# EAGLE design M304A (EAGLE 6.6.0)
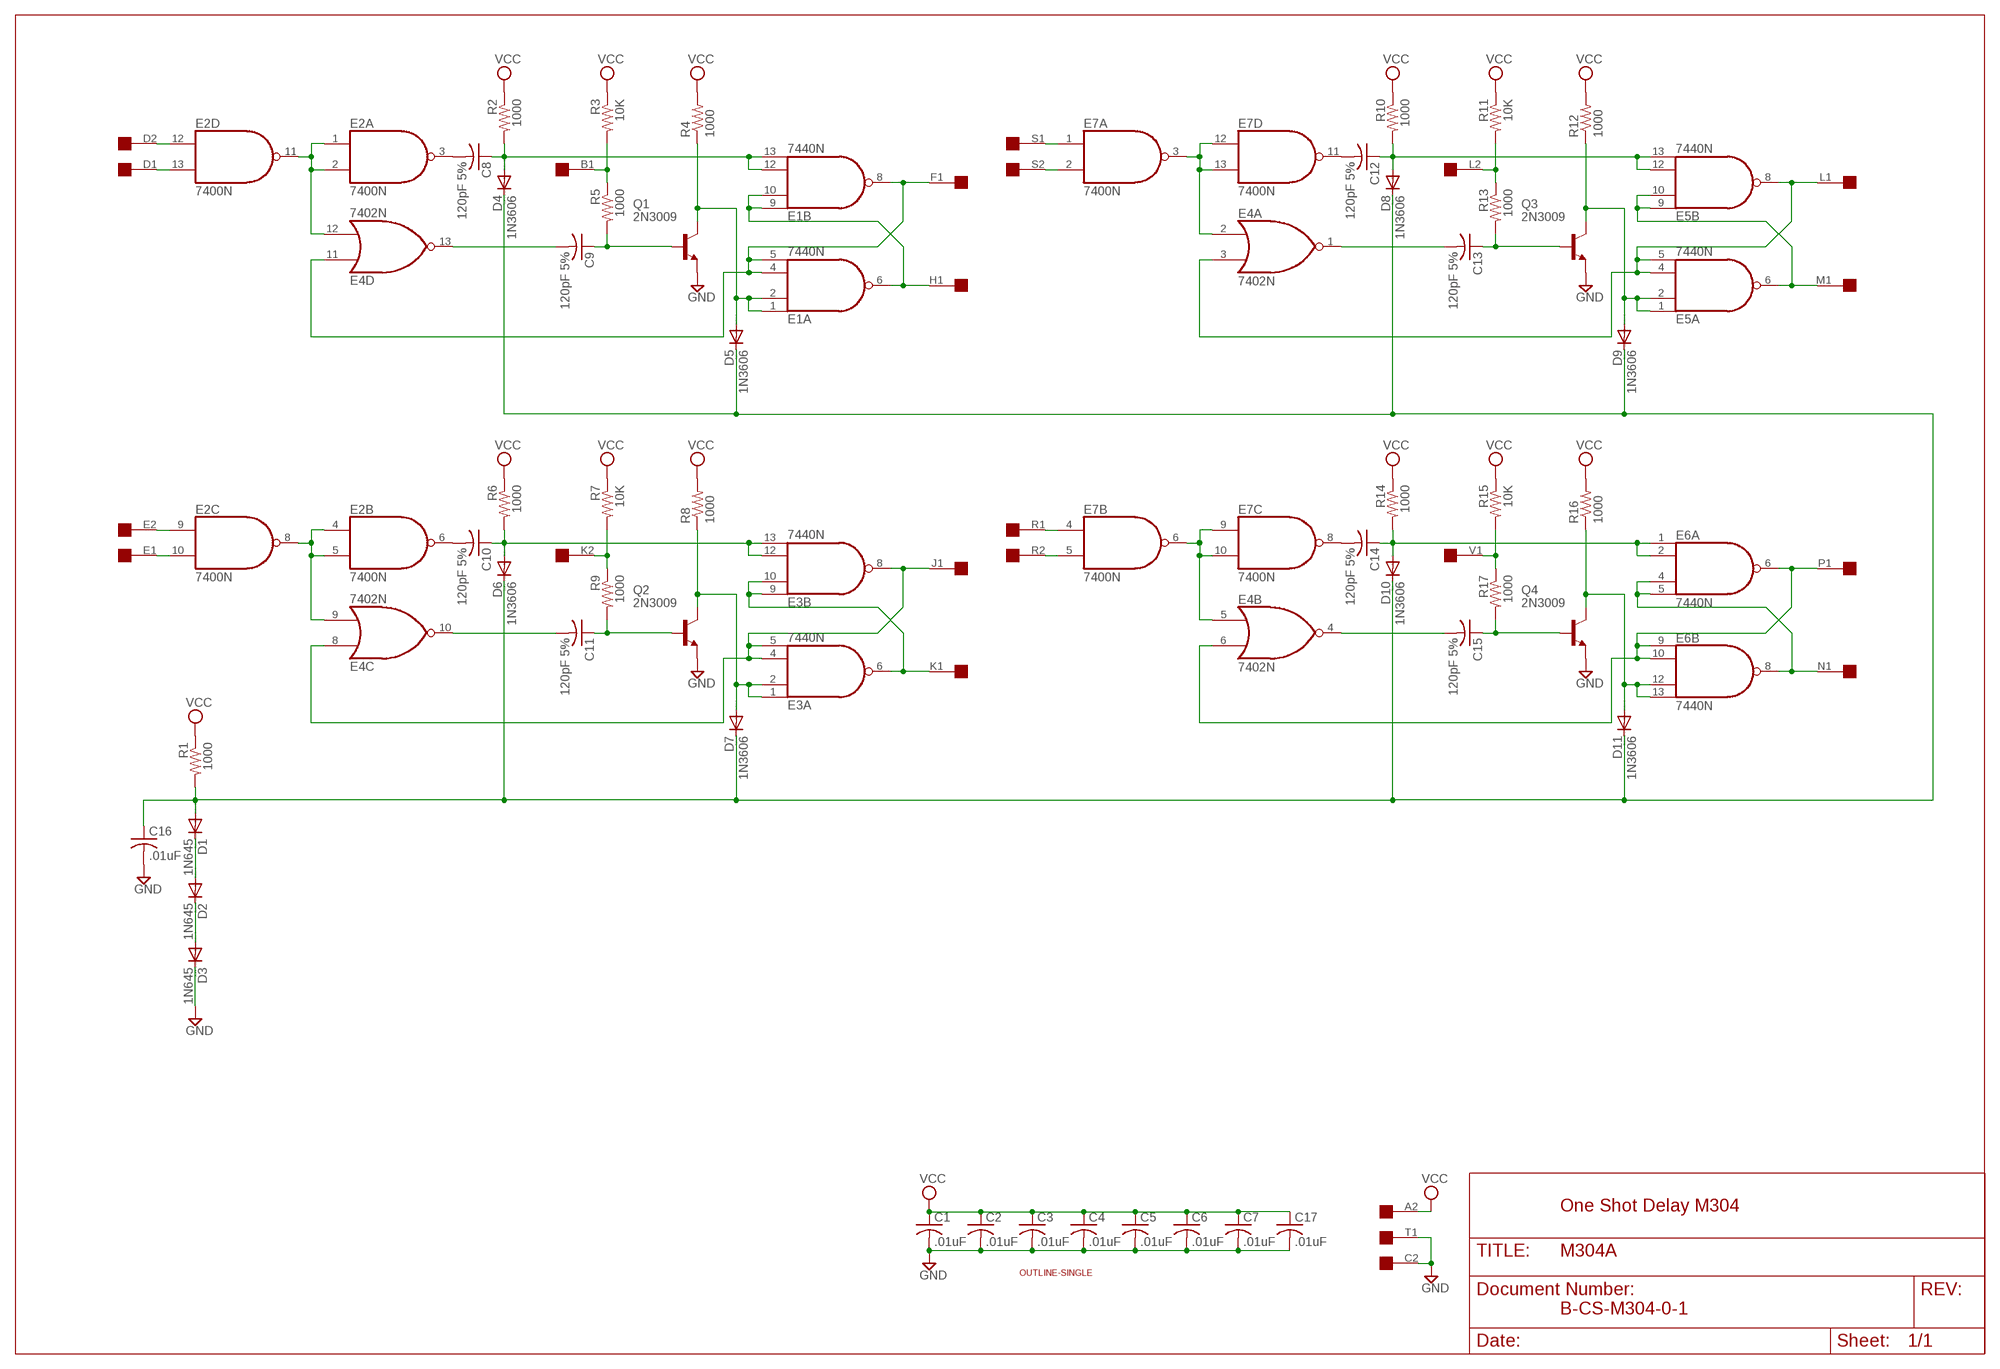
[diagram p0: schematic, sheet 1]

## Parts
C1  .01uF  C-US050-025X075  [C050-025X075]
C2  .01uF  C-US050-025X075  [C050-025X075]
C3  .01uF  C-US050-025X075  [C050-025X075]
C4  .01uF  C-US050-025X075  [C050-025X075]
C5  .01uF  C-US050-025X075  [C050-025X075]
C6  .01uF  C-US050-025X075  [C050-025X075]
C7  .01uF  C-US050-025X075  [C050-025X075]
C8  120pF 5%  C-US050-025X075  [C050-025X075]
C9  120pF 5%  C-US050-025X075  [C050-025X075]
C10  120pF 5%  C-US050-025X075  [C050-025X075]
C11  120pF 5%  C-US050-025X075  [C050-025X075]
C12  120pF 5%  C-US050-025X075  [C050-025X075]
C13  120pF 5%  C-US050-025X075  [C050-025X075]
C14  120pF 5%  C-US050-025X075  [C050-025X075]
C15  120pF 5%  C-US050-025X075  [C050-025X075]
C16  .01uF  C-US050-025X075  [C050-025X075]
C17  .01uF  C-US050-025X075  [C050-025X075]
D1  1N645  1N4148DO35-10  [DO35-10]
D2  1N645  1N4148DO35-10  [DO35-10]
D3  1N645  1N4148DO35-10  [DO35-10]
D4  1N3606  1N4148DO35-10  [DO35-10]
D5  1N3606  1N4148DO35-10  [DO35-10]
D6  1N3606  1N4148DO35-10  [DO35-10]
D7  1N3606  1N4148DO35-10  [DO35-10]
D8  1N3606  1N4148DO35-10  [DO35-10]
D9  1N3606  1N4148DO35-10  [DO35-10]
D10  1N3606  1N4148DO35-10  [DO35-10]
D11  1N3606  1N4148DO35-10  [DO35-10]
E1  7440N  74S20N  [DIL14]
E2  7400N  [DIL14]
E3  7440N  74S20N  [DIL14]
E4  7402N  [DIL14]
E5  7440N  74S20N  [DIL14]
E6  7440N  74S20N  [DIL14]
E7  7400N  [DIL14]
Q1  2N3009  2N3019-NPN-TO39-EBC  [TO39]
Q2  2N3009  2N3019-NPN-TO39-EBC  [TO39]
Q3  2N3009  2N3019-NPN-TO39-EBC  [TO39]
Q4  2N3009  2N3019-NPN-TO39-EBC  [TO39]
R1  1000  R-US_0207/10  [0207/10]
R2  1000  R-US_0207/10  [0207/10]
R3  10K  R-US_0207/10  [0207/10]
R4  1000  R-US_0207/10  [0207/10]
R5  1000  R-US_0207/10  [0207/10]
R6  1000  R-US_0207/10  [0207/10]
R7  10K  R-US_0207/10  [0207/10]
R8  1000  R-US_0207/10  [0207/10]
R9  1000  R-US_0207/10  [0207/10]
R10  1000  R-US_0207/10  [0207/10]
R11  10K  R-US_0207/10  [0207/10]
R12  1000  R-US_0207/10  [0207/10]
R13  1000  R-US_0207/10  [0207/10]
R14  1000  R-US_0207/10  [0207/10]
R15  10K  R-US_0207/10  [0207/10]
R16  1000  R-US_0207/10  [0207/10]
R17  1000  R-US_0207/10  [0207/10]
U$1  SINGLE  [EDGE-CON2]
U$2  OUTLINE-SINGLE  [SINGLE]

## Nets
GND [power]: C1.2 C2.2 C3.2 C4.2 C5.2 C6.2 C7.2 C16.2 C17.2 D3.C Q1.1(E) Q2.1(E) Q3.1(E) Q4.1(E) U$1.C2 U$1.T1
N$1: C16.1 D1.A D4.C D5.C D6.C D7.C D8.C D9.C D10.C D11.C R1.2
N$2: D5.A E1.1(A:I0) E1.2(A:I1) Q1.3(C) R4.1
N$3: E2.1(A:I0) E2.2(A:I1) E2.11(D:O) E4.12(D:I1)
N$4: E2.13(D:I1) U$1.D1
N$5: D1.C D2.A
N$6: E2.12(D:I0) U$1.D2
N$7: C8.2 E2.3(A:O)
N$8: C8.1 D4.A E1.12(B:I2) E1.13(B:I3) R2.2
N$9: D2.C D3.A
N$10: C9.2 E4.13(D:O)
N$11: C9.1 Q1.2(B) R5.2
N$12: R3.2 R5.1 U$1.B1
N$13: E1.4(A:I2) E1.5(A:I3) E1.8(B:O) E4.11(D:I0) U$1.F1
N$14: E1.6(A:O) E1.9(B:I0) E1.10(B:I1) U$1.H1
N$17: D7.A E3.1(A:I0) E3.2(A:I1) Q2.3(C) R8.1
N$18: E2.4(B:I0) E2.5(B:I1) E2.8(C:O) E4.9(C:I1)
N$19: E2.9(C:I0) U$1.E2
N$20: E2.10(C:I1) U$1.E1
N$21: C10.2 E2.6(B:O)
N$22: C10.1 D6.A E3.12(B:I2) E3.13(B:I3) R6.2
N$23: C11.2 E4.10(C:O)
N$24: C11.1 Q2.2(B) R9.2
N$25: R7.2 R9.1 U$1.K2
N$26: E3.4(A:I2) E3.5(A:I3) E3.8(B:O) E4.8(C:I0) U$1.J1
N$27: E3.6(A:O) E3.9(B:I0) E3.10(B:I1) U$1.K1
N$29: D9.A E5.1(A:I0) E5.2(A:I1) Q3.3(C) R12.1
N$30: E4.2(A:I0) E7.3(A:O) E7.12(D:I0) E7.13(D:I1)
N$31: E7.1(A:I0) U$1.S1
N$32: E7.2(A:I1) U$1.S2
N$33: C12.2 E7.11(D:O)
N$34: C12.1 D8.A E5.12(B:I2) E5.13(B:I3) R10.2
N$35: C13.2 E4.1(A:O)
N$36: C13.1 Q3.2(B) R13.2
N$37: R11.2 R13.1 U$1.L2
N$38: E4.3(A:I1) E5.4(A:I2) E5.5(A:I3) E5.8(B:O) U$1.L1
N$39: E5.6(A:O) E5.9(B:I0) E5.10(B:I1) U$1.M1
N$41: D11.A E6.12(B:I2) E6.13(B:I3) Q4.3(C) R16.1
N$42: E4.5(B:I0) E7.6(B:O) E7.9(C:I0) E7.10(C:I1)
N$43: E7.4(B:I0) U$1.R1
N$44: E7.5(B:I1) U$1.R2
N$45: C14.2 E7.8(C:O)
N$46: C14.1 D10.A E6.1(A:I0) E6.2(A:I1) R14.2
N$47: C15.2 E4.4(B:O)
N$48: C15.1 Q4.2(B) R17.2
N$49: R15.2 R17.1 U$1.V1
N$50: E4.6(B:I1) E6.6(A:O) E6.9(B:I0) E6.10(B:I1) U$1.P1
N$51: E6.4(A:I2) E6.5(A:I3) E6.8(B:O) U$1.N1
VCC [power]: C1.1 C2.1 C3.1 C4.1 C5.1 C6.1 C7.1 C17.1 R1.1 R2.1 R3.1 R4.2 R6.1 R7.1 R8.2 R10.1 R11.1 R12.2 R14.1 R15.1 R16.2 U$1.A2
Unconnected: U$1.A1 U$1.B2 U$1.C1 U$1.F2 U$1.H2 U$1.J2 U$1.M2 U$1.N2 U$1.P2 U$1.T2 U$1.U1 U$1.U2 U$1.V2

## Notes on the sheet
- One Shot Delay M304
- B-CS-M304-0-1

## Power pins joined to a net without a drawn wire
GND: E1.7(P:GND) E2.7(P:GND) E3.7(P:GND) E4.7(P:GND) E5.7(P:GND) E6.7(P:GND) E7.7(P:GND)
VCC: E1.14(P:VCC) E2.14(P:VCC) E3.14(P:VCC) E4.14(P:VCC) E5.14(P:VCC) E6.14(P:VCC) E7.14(P:VCC)

## Library data of the parts
C1-C17 = rcl:C-US: CAPACITOR, American symbol
D1-D11 = diode:1N4148: DIODE high speed (Philips)
E1 E3 E5 E6 = 74xx-us:74*20: Dual 4-input NAND gate
E2 E7 = 74xx-us:74*00: Quad 2-input NAND gate
E4 = 74xx-us:74*02: Quad 2-input NOR gate
Q1-Q4 = transistor:*-NPN-: NPN Transistror BF959 corrected 2008.03.06
R1-R17 = rcl:R-US_: RESISTOR, American symbol
U$1 = dec-con:SINGLE: Single-Height DEC board
U$2 = dec-con:OUTLINE-*: Board outlines for DEC boards.

## Net classes
1 power: width 0.813 mm

## Board
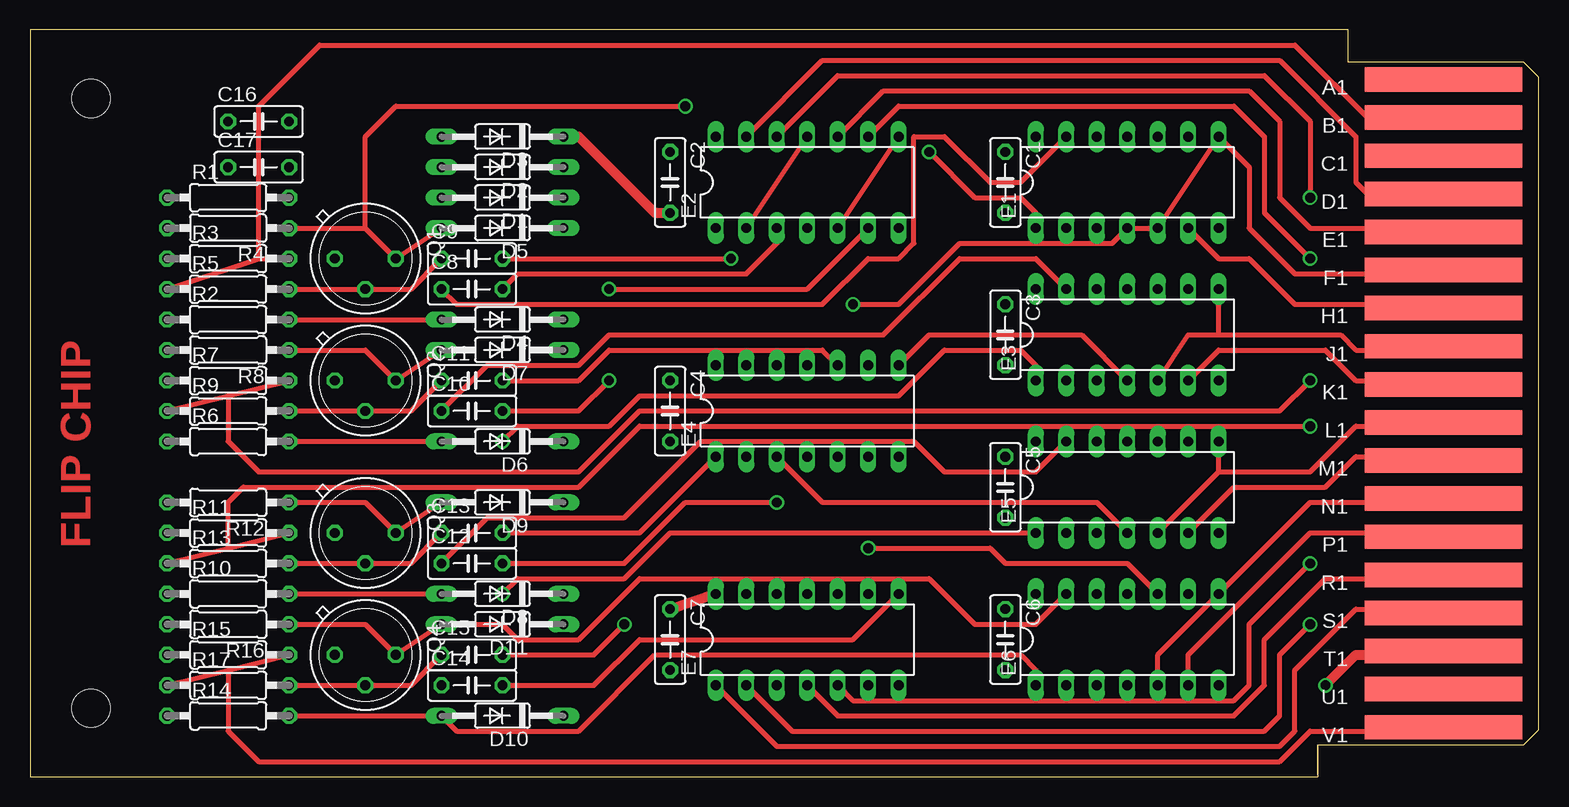
[diagram p1: board, top side]
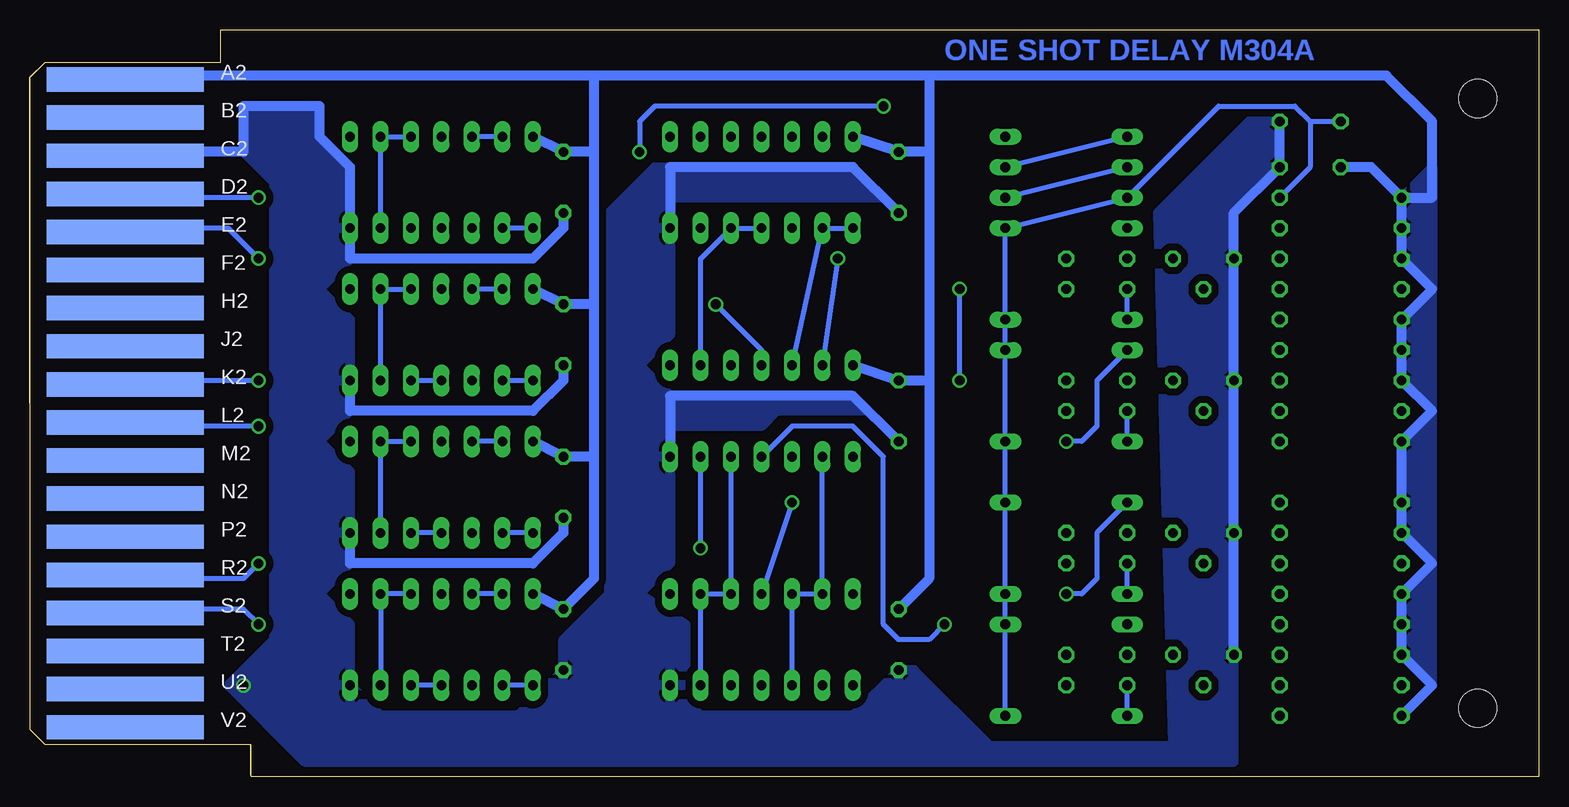
[diagram p2: board, bottom side, seen from below]

Size 125.73 x 62.23 mm. Coordinates in mm from the lower left corner, seen from the top.
Copper layers (1+16): Top 0.035mm / dielectric 1.5mm / Bottom 0.035mm
Design rules "16mils": minimum track width 16mil, minimum drill 32mil, track to track 15mil, track to pad 10mil, pad to pad 10mil, via to via 10mil, smd to smd 10mil, copper to edge 13mil, drill to drill 10mil, minimum pad ring 10mil, minimum via ring 8mil, stop-mask expansion 0mil, vias tented up to drill 0mil, thermal gap 10mil

### Footprints (pad centres in the part's own frame; a part is rotated, then mirrored left to right if it is on the bottom)
C050-025X075 = drill 0.813 octagon: 1 -2.54,0; 2 2.54,0
DO35-10 = drill 0.813 long: A 5.08,0; C -5.08,0
DIL14 = drill 0.813 long: 1 -7.62,-3.81; 2 -5.08,-3.81; 3 -2.54,-3.81; 4 0,-3.81; 5 2.54,-3.81; 6 5.08,-3.81; 7 7.62,-3.81; 8 7.62,3.81; 9 5.08,3.81; 10 2.54,3.81; 11 0,3.81; 12 -2.54,3.81; 13 -5.08,3.81; 14 -7.62,3.81
TO39 = drill 0.813 octagon: 1 0,-2.54; 2 2.54,0; 3 0,2.54
0207/10 = drill 0.813 octagon: 1 -5.08,0; 2 5.08,0
EDGE-CON2 = smd 13.106 x 2.032: A1 7.938,4.128; B1 7.938,7.303; C1 7.938,10.477; D1 7.938,13.652; E1 7.938,16.828; F1 7.938,20.003; H1 7.938,23.177; J1 7.938,26.352; K1 7.938,29.527; L1 7.938,32.703; M1 7.938,35.877; N1 7.938,39.053; P1 7.938,42.227; R1 7.938,45.403; S1 7.938,48.578; T1 7.938,51.752; U1 7.938,54.928; V1 7.938,58.102 | smd 13.106 x 2.032 bottom: A2 7.938,4.128; B2 7.938,7.303; C2 7.938,10.477; D2 7.938,13.652; E2 7.938,16.828; F2 7.938,20.003; H2 7.938,23.177; J2 7.938,26.352; K2 7.938,29.527; L2 7.938,32.703; M2 7.938,35.877; N2 7.938,39.053; P2 7.938,42.227; R2 7.938,45.403; S2 7.938,48.578; T2 7.938,51.752; U2 7.938,54.928; V2 7.938,58.102
SINGLE = hole 3.175: 120.65,56.515; 120.65,5.715

### Placement (x,y rotation side)
C1  81.28,49.53 270 top
C2  53.34,49.53 270 top
C3  81.28,36.83 270 top
C4  53.34,30.48 270 top
C5  81.28,24.13 270 top
C6  81.28,11.43 270 top
C7  53.34,11.43 270 top
C8  36.83,40.64 0 top
C9  36.83,43.18 0 top
C10  36.83,30.48 0 top
C11  36.83,33.02 0 top
C12  36.83,17.78 0 top
C13  36.83,20.32 0 top
C14  36.83,7.62 0 top
C15  36.83,10.16 0 top
C16  19.05,54.61 0 top
C17  19.05,50.8 0 top
D1  39.37,48.26 180 top
D2  39.37,50.8 180 top
D3  39.37,53.34 180 top
D4  39.37,38.1 180 top
D5  39.37,45.72 180 top
D6  39.37,27.94 180 top
D7  39.37,35.56 180 top
D8  39.37,15.24 180 top
D9  39.37,22.86 180 top
D10  39.37,5.08 180 top
D11  39.37,12.7 180 top
E1  91.44,49.53 0 top
E2  64.77,49.53 0 top
E3  91.44,36.83 0 top
E4  64.77,30.48 0 top
E5  91.44,24.13 0 top
E6  91.44,11.43 0 top
E7  64.77,11.43 0 top
Q1  27.94,43.18 270 top
Q2  27.94,33.02 270 top
Q3  27.94,20.32 270 top
Q4  27.94,10.16 270 top
R1  16.51,48.26 0 top
R2  16.51,38.1 0 top
R3  16.51,43.18 0 top
R4  16.51,45.72 180 top
R5  16.51,40.64 0 top
R6  16.51,27.94 0 top
R7  16.51,33.02 0 top
R8  16.51,35.56 180 top
R9  16.51,30.48 0 top
R10  16.51,15.24 0 top
R11  16.51,20.32 0 top
R12  16.51,22.86 180 top
R13  16.51,17.78 0 top
R14  16.51,5.08 0 top
R15  16.51,10.16 0 top
R16  16.51,12.7 180 top
R17  16.51,7.62 0 top
U$1  125.73,62.23 180 top
U$2  125.73,62.23 180 top
U$3  [FLIPCHIP]  0,0 0 top

### Tracks (layer width: path | path; a pad name or v marks a point on that pad's centre or on a via)
GND  (via drill 0.81)
  Top 0.813: U$1.T1 116.84,10.16 110.49,10.16 v107.95,7.62 | D3.C 45.72,53.34 52.07,46.99 C2.2
  Bottom 0.813: C16.2 C17.2 25.4,46.99 Q1.1 Q2.1 Q3.1 Q4.1 | U$1.C2 116.84,52.07 107.95,52.07 107.95,55.88 101.6,55.88 101.6,53.34 99.06,50.8 E1.7 99.06,43.18 83.82,43.18 81.28,45.72 C1.2 | C3.2 81.28,33.02 83.82,30.48 99.06,30.48 E3.7 | C5.2 81.28,20.32 83.82,17.78 99.06,17.78 E5.7 | C2.2 57.15,50.8 72.39,50.8 E2.7 | C4.2 57.15,31.75 72.39,31.75 E4.7
  pour Bottom (isolate 0.61): 21.59,54.61 24.13,54.61 31.75,46.99 30.48,1.27 25.4,1.27 25.4,46.99 21.59,50.8
  pour Bottom (isolate 0.61): 30.48,2.54 45.72,2.54 52.07,8.89 53.34,8.89 57.15,5.08 69.85,5.08 73.66,8.89 81.28,8.89 85.09,5.08 96.52,5.08 99.06,7.62 101.6,7.62 101.6,1.27 30.48,1.27
  pour Bottom (isolate 0.61): 99.06,1.27 99.06,12.7 101.6,15.24 99.06,17.78 99.06,25.4 101.6,27.94 99.06,30.48 99.06,38.1 101.6,40.64 99.06,43.18 99.06,50.8 101.6,53.34 101.6,55.88 107.95,55.88 107.95,52.07 105.41,49.53 105.41,11.43 109.22,7.62 102.87,1.27
  pour Bottom (isolate 0.61): 81.28,7.62 81.28,11.43 77.47,15.24 77.47,46.99 73.66,50.8 57.15,50.8 54.61,48.26 72.39,48.26 72.39,36.83 74.93,34.29 72.39,31.75 57.15,31.75 55.88,30.48 63.5,30.48 64.77,29.21 72.39,29.21 72.39,17.78 74.93,15.24 71.12,12.7 71.12,7.62
N$1
  Bottom 0.406: D10.C D11.C D8.C D9.C D6.C D7.C D4.C D5.C D1.A 26.67,55.88 20.32,55.88 19.05,54.61 | R1.2 19.05,50.8 19.05,54.61 | 19.05,54.61 C16.1
N$2  (via drill 0.81)
  Top 0.406: R4.1 27.94,45.72 | 27.94,45.72 Q1.3 D5.A | 27.94,45.72 27.94,53.34 30.48,55.88 v54.61,55.88 | v74.93,52.07 78.74,48.26 82.55,48.26 83.82,46.99 E1.1
  Bottom 0.406: E1.1 E1.2 | v54.61,55.88 73.66,55.88 74.93,54.61 v74.93,52.07
N$3
  Top 0.406: E2.2 E2.11
  Bottom 0.406: E4.12 E2.2 E2.1
N$4
  Top 0.406: E2.13 66.04,59.69 104.14,59.69 110.49,53.34 110.49,49.53 111.76,48.26 116.84,48.26 U$1.D1
N$5
  Bottom 0.406: D2.A D1.C
N$6  (via drill 0.81)
  Top 0.406: E2.12 67.31,58.42 102.87,58.42 106.68,54.61 v106.68,48.26
  Bottom 0.406: U$1.D2 116.84,48.26 v106.68,48.26
N$7
  Top 0.406: E2.3 62.23,44.45 59.69,41.91 40.64,41.91 C8.2
N$8
  Top 0.406: R2.2 D4.A | E1.13 82.55,49.53 80.01,49.53 76.2,53.34 73.66,53.34 73.66,44.45 72.39,43.18 69.85,43.18 66.04,39.37 35.56,39.37 C8.1
  Bottom 0.406: E1.13 E1.12 | D4.A C8.1
N$9
  Bottom 0.406: D3.A D2.C
N$10  (via drill 0.81)
  Top 0.406: C9.2 v58.42,43.18
  Bottom 0.406: v58.42,43.18 E4.13
N$11
  Top 0.406: R5.2 Q1.2 31.75,40.64 C9.1
N$12
  Top 0.406: R5.1 19.05,43.18 | 19.05,43.18 R3.2 | 19.05,43.18 19.05,55.88 24.13,60.96 105.41,60.96 111.76,54.61 116.84,54.61 U$1.B1
N$13  (via drill 0.81)
  Top 0.406: U$1.F1 116.84,41.91 105.41,41.91 101.6,45.72 101.6,50.8 E1.8 E1.5 E1.4 90.17,44.45 77.47,44.45 72.39,39.37 v68.58,39.37
  Bottom 0.406: v68.58,39.37 64.77,35.56 E4.11
N$14
  Top 0.406: U$1.H1 116.84,39.37 105.41,39.37 101.6,43.18 99.06,43.18 E1.6
  Bottom 0.406: E1.10 E1.9 E1.6
N$17  (via drill 0.81)
  Top 0.406: R8.1 27.94,35.56 Q2.3 D7.A | E3.1 83.82,34.29 82.55,35.56 76.2,35.56 72.39,31.75 50.8,31.75 48.26,29.21 40.64,29.21 v39.37,27.94
  Bottom 0.406: E3.1 E3.2 | v39.37,27.94 38.1,27.94 36.83,29.21 36.83,33.02 D7.A
N$18
  Top 0.406: E2.5 E2.8
  Bottom 0.406: E4.9 69.85,43.18 E2.5 E2.4
N$19  (via drill 0.81)
  Top 0.406: E2.9 72.39,55.88 100.33,55.88 102.87,53.34 102.87,46.99 v106.68,43.18
  Bottom 0.406: U$1.E2 116.84,45.72 109.22,45.72 v106.68,43.18
N$20
  Top 0.406: E2.10 71.12,57.15 101.6,57.15 104.14,54.61 104.14,48.26 106.68,45.72 116.84,45.72 U$1.E1
N$21  (via drill 0.81)
  Top 0.406: E2.6 64.77,40.64 v48.26,40.64 | v48.26,33.02 45.72,30.48 C10.2
  Bottom 0.406: v48.26,33.02 v48.26,40.64
N$22
  Top 0.406: R6.2 D6.A | E3.13 83.82,43.18 77.47,43.18 71.12,36.83 48.26,36.83 45.72,34.29 38.1,34.29 C10.1
  Bottom 0.406: E3.13 E3.12 | D6.A C10.1
N$23
  Top 0.406: E4.10 66.04,35.56 48.26,35.56 45.72,33.02 C11.2
N$24
  Top 0.406: R9.2 Q2.2 31.75,30.48 C11.1
N$25  (via drill 0.81)
  Top 0.406: R9.1 16.51,31.75 | 16.51,31.75 R7.2 | 16.51,31.75 16.51,27.94 19.05,25.4 45.72,25.4 50.8,30.48 104.14,30.48 v106.68,33.02
  Bottom 0.406: U$1.K2 116.84,33.02 v106.68,33.02
N$26
  Top 0.406: E3.5 96.52,36.83 | U$1.J1 116.84,35.56 110.49,35.56 109.22,36.83 96.52,36.83 | 96.52,36.83 99.06,36.83 E3.8 | E4.8 74.93,36.83 87.63,36.83 E3.4
  Bottom 0.406: E3.4 E3.5
N$27
  Top 0.406: U$1.K1 116.84,33.02 110.49,33.02 107.95,35.56 99.06,35.56 E3.6
  Bottom 0.406: E3.10 E3.9 E3.6
N$29  (via drill 0.81)
  Top 0.406: R12.1 27.94,22.86 Q3.3 D9.A | E5.1 53.34,20.32 49.53,16.51 40.64,16.51 v39.37,15.24
  Bottom 0.406: E5.1 E5.2 | D9.A 36.83,20.32 36.83,16.51 38.1,15.24 v39.37,15.24
N$30
  Bottom 0.406: E4.2 E7.13 E7.12 E7.3
N$31
  Top 0.406: E7.1 62.23,2.54 104.14,2.54 105.41,3.81 105.41,8.89 110.49,13.97 116.84,13.97 U$1.S1
N$32  (via drill 0.81)
  Top 0.406: E7.2 63.5,3.81 102.87,3.81 104.14,5.08 104.14,10.16 v106.68,12.7
  Bottom 0.406: U$1.S2 116.84,13.97 107.95,13.97 v106.68,12.7
N$33  (via drill 0.81)
  Top 0.406: C12.2 49.53,17.78 54.61,22.86 v62.23,22.86
  Bottom 0.406: v62.23,22.86 E7.11
N$34
  Top 0.406: R10.2 D8.A | E5.13 83.82,25.4 76.2,25.4 73.66,27.94 55.88,27.94 49.53,21.59 38.1,21.59 C12.1
  Bottom 0.406: E5.13 E5.12 | D8.A C12.1
N$35
  Top 0.406: C13.2 50.8,20.32 E4.1
N$36
  Top 0.406: R13.2 Q3.2 31.75,17.78 C13.1
N$37  (via drill 0.81)
  Top 0.406: R13.1 16.51,19.05 | 16.51,19.05 R11.2 | 16.51,19.05 16.51,22.86 17.78,24.13 45.72,24.13 50.8,29.21 v106.68,29.21
  Bottom 0.406: U$1.L2 116.84,29.21 v106.68,29.21
N$38
  Top 0.406: E5.5 99.06,25.4 | 99.06,25.4 E5.8 | U$1.L1 116.84,29.21 110.49,29.21 106.68,25.4 99.06,25.4 | E5.4 88.9,22.86 66.04,22.86 E4.3
  Bottom 0.406: E5.4 E5.5
N$39
  Top 0.406: U$1.M1 116.84,26.67 110.49,26.67 107.95,24.13 100.33,24.13 E5.6
  Bottom 0.406: E5.10 E5.9 E5.6
N$41
  Top 0.406: R16.1 27.94,12.7 Q4.3 D11.A 39.37,12.7 40.64,11.43 45.72,11.43 50.8,16.51 74.93,16.51 78.74,12.7 83.82,12.7 E6.13
  Bottom 0.406: E6.13 E6.12
N$42
  Bottom 0.406: E4.5 E7.10 E7.9 E7.6
N$43
  Top 0.406: E7.4 67.31,5.08 100.33,5.08 102.87,7.62 102.87,11.43 107.95,16.51 116.84,16.51 U$1.R1
N$44  (via drill 0.81)
  Top 0.406: E7.5 68.58,6.35 100.33,6.35 101.6,7.62 101.6,12.7 v106.68,17.78
  Bottom 0.406: U$1.R2 116.84,16.51 107.95,16.51 v106.68,17.78
N$45
  Top 0.406: E7.8 68.58,11.43 50.8,11.43 46.99,7.62 C14.2
N$46
  Top 0.406: R14.2 D10.A 35.56,3.81 45.72,3.81 52.07,10.16 82.55,10.16 83.82,8.89 E6.1
  Bottom 0.406: E6.1 E6.2 | D10.A C14.1
N$47  (via drill 0.81)
  Top 0.406: C15.2 46.99,10.16 v49.53,12.7
  Bottom 0.406: v49.53,12.7 50.8,11.43 53.34,11.43 54.61,12.7 54.61,26.67 57.15,29.21 62.23,29.21 E4.4
N$48
  Top 0.406: R17.2 Q4.2 31.75,7.62 C15.1
N$49
  Top 0.406: R17.1 16.51,8.89 | 16.51,8.89 R15.2 | U$1.V1 116.84,3.81 106.68,3.81 104.14,1.27 19.05,1.27 16.51,3.81 16.51,8.89
N$50  (via drill 0.81)
  Top 0.406: U$1.P1 116.84,20.32 106.68,20.32 96.52,10.16 E6.6 | v69.85,19.05 80.01,19.05 81.28,17.78 91.44,17.78 E6.10
  Bottom 0.406: E6.10 E6.9 E6.6 | v69.85,19.05 E4.6
N$51
  Top 0.406: E6.5 93.98,10.16 E6.8 106.68,22.86 116.84,22.86 U$1.N1
  Bottom 0.406: E6.4 E6.5
VCC
  Top 0.813: C7.1 E7.14
  Bottom 0.813: R14.1 8.89,7.62 R15.1 R16.2 R10.1 8.89,17.78 R11.1 R12.2 R6.1 8.89,30.48 R7.1 R8.2 R2.1 8.89,40.64 R3.1 R4.2 R1.1 | C17.1 13.97,50.8 R1.1 | U$1.A2 117.24,58.02 116.84,58.42 78.74,58.42 | 78.74,26.67 78.74,16.51 C6.1 E6.14 | 78.74,39.37 78.74,26.67 | 78.74,52.07 78.74,39.37 | 78.74,58.42 78.74,52.07 | E5.14 C5.1 78.74,26.67 | E3.14 C3.1 78.74,39.37 | 78.74,52.07 C1.1 E1.14 | C7.1 50.8,16.51 50.8,33.02 | 50.8,52.07 50.8,33.02 | 50.8,58.42 50.8,52.07 | 50.8,58.42 78.74,58.42 | 50.8,52.07 C2.1 E2.14 | 50.8,33.02 C4.1 E4.14 | 50.8,58.42 12.7,58.42 8.89,54.61 8.89,48.26 R1.1
  pour Bottom: 8.89,50.8 8.89,40.64 11.43,43.18 11.43,48.26
  pour Bottom: 8.89,30.48 8.89,40.64 11.43,38.1 11.43,33.02
  pour Bottom: 8.89,17.78 8.89,30.48 11.43,27.94 11.43,20.32
  pour Bottom: 8.89,7.62 8.89,17.78 11.43,15.24 11.43,10.16

### Text on the board
Bottom: ONE SHOT DELAY M304A